# Altium schematic sheet SW6106 Demo board.SchDoc
size A2
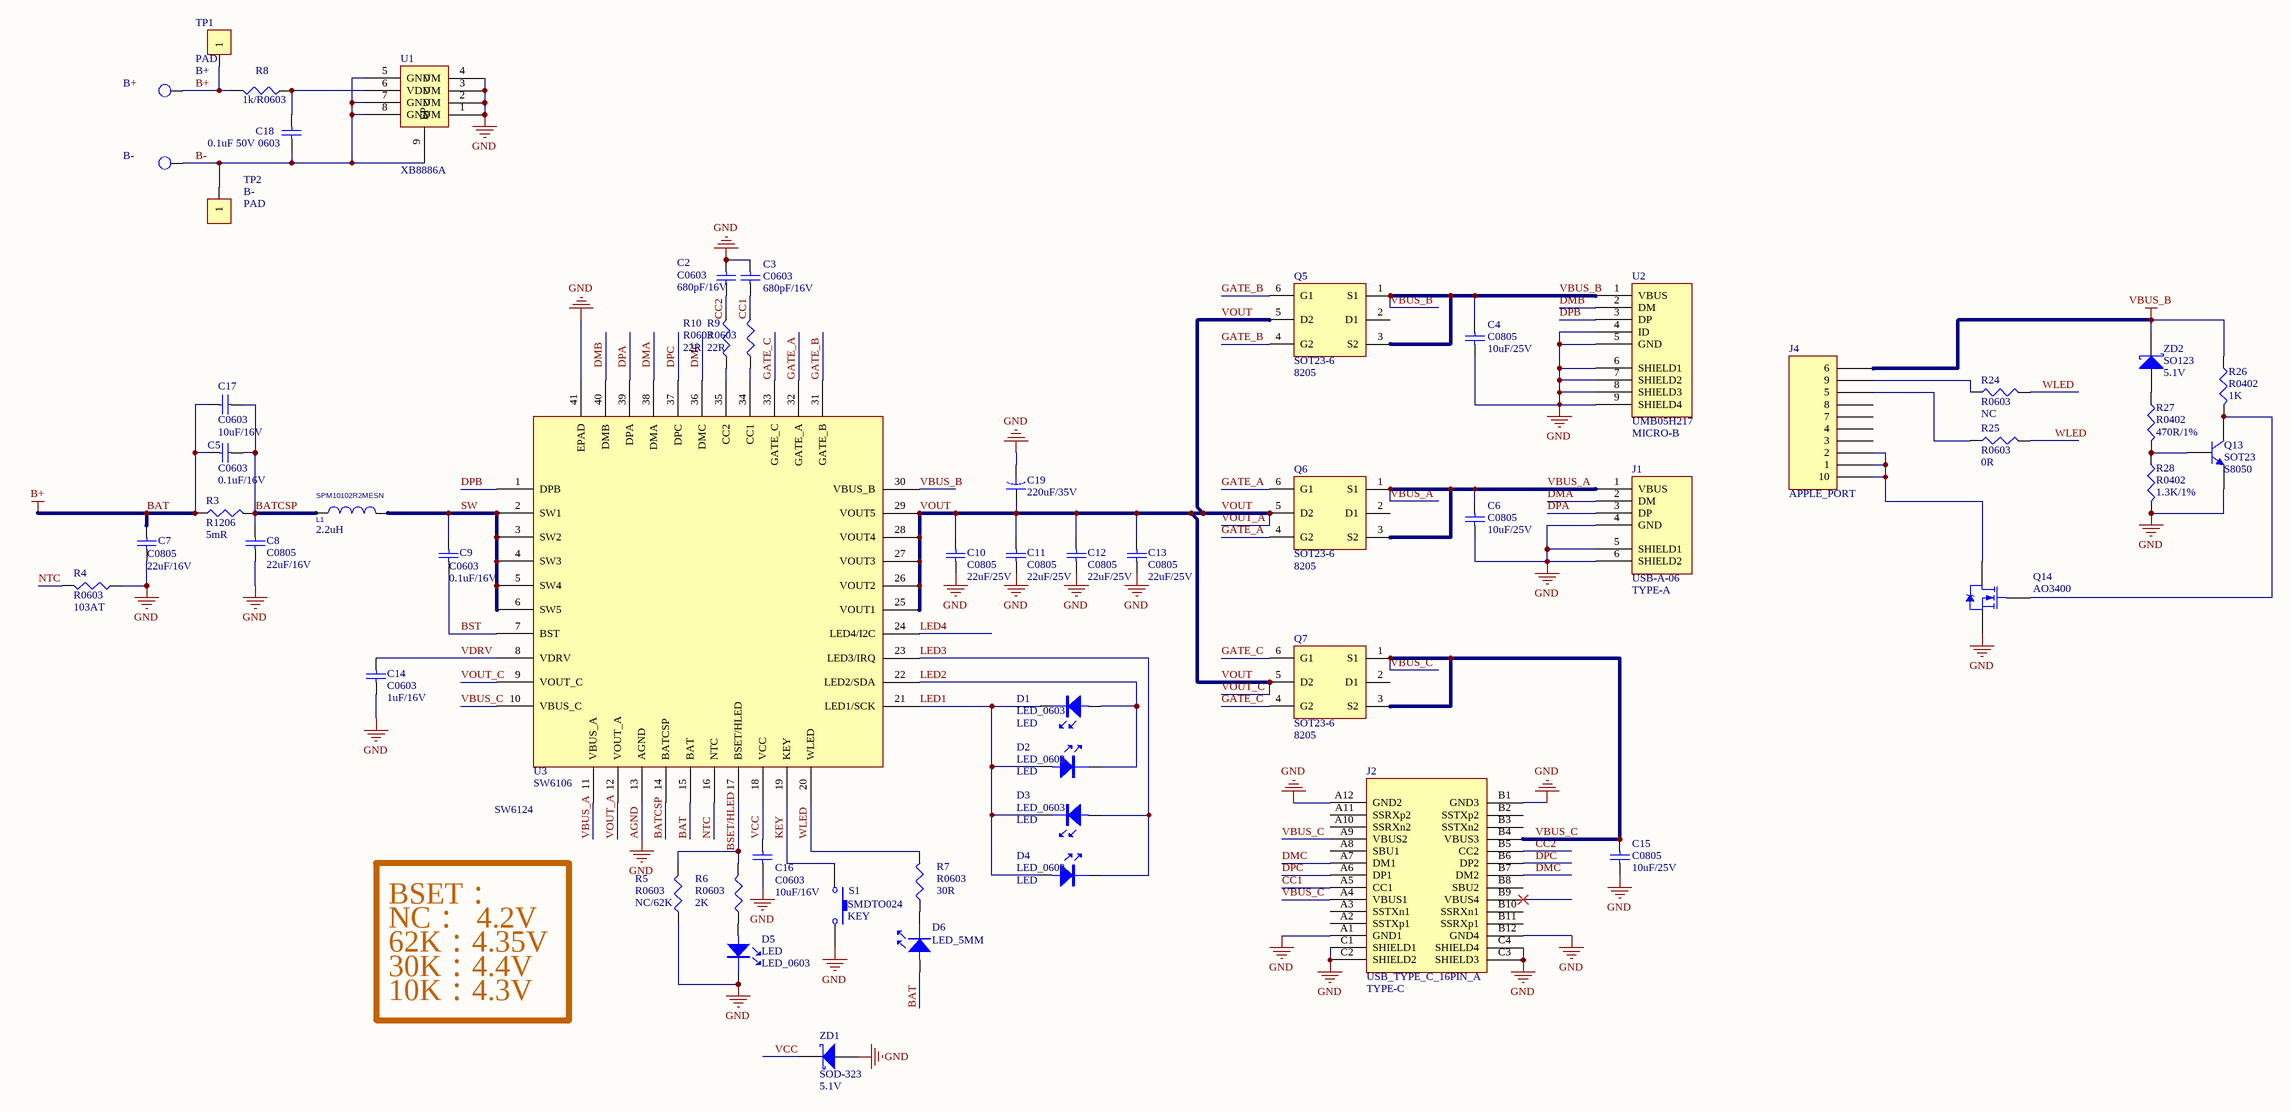
[diagram p0: SW6106 Demo board.SchDoc]

## Parts
B+  PDA  [PAD]  (value not drawn)
B-  PDA  [PAD]  (value not drawn)
C2  C0603  value 680pF/16V  [C0603]
C3  C0603  value 680pF/16V  [C0603]
C4  C0805  value 10uF/25V  [C0805]
C5  C0603  value 0.1uF/16V  [C0603]
C6  C0805  value 10uF/25V  [C0805]
C7  C0805  value 22uF/16V  [C0805]
C8  C0805  value 22uF/16V  [C0805]
C9  C0603  value 0.1uF/16V  [C0603]
C10  C0805  value 22uF/25V  [C0805]
C11  C0805  value 22uF/25V  [C0805]
C12  C0805  value 22uF/25V  [C0805]
C13  C0805  value 22uF/25V  [C0805]
C14  C0603  value 1uF/16V  [C0603]
C15  C0805  value 10uF/25V  [C0805]
C16  C0603  value 10uF/16V  [C0603]
C17  C0603  value 10uF/16V  [C0603]
C18  0.1uF 50V 0603  [C0402]
C19  value 220uF/35V  [Cap  ( E )  6.5 * 12.0  Erect]  (hidden comment: E - Cap)
D1  LED  [LED_0603]
D2  LED  [LED_0603]
D3  LED  [LED_0603]
D4  LED  [LED_0603]
D5  LED  [LED_0603]
D6  LED_5MM  [LED_5MM]
J1  value TYPE-A  [USB-A-06]  (hidden comment: TYPE-A-1)
J2  TYPE-C  [USB_TYPE_C_16PIN_A]
J4  APPLE_PORT  [Lightning]
L1  SPM10102R2MESN  value 2.2uH  [INDUCTOR_SPM1010]
Q5  8205  [SOT23-6]
Q6  8205  [SOT23-6]
Q7  8205  [SOT23-6]
Q13  Footprint: SOT23  [SOT-23]  (hidden comment: S8050)
Q14  value AO3400  [SOT-23-3]  (hidden comment: NMOS-2)
R3  R1206  value 5mR  [R1206]
R4  R0603  value 103AT  [R0603]
R5  R0603  value NC/62K  [R0603]
R6  R0603  value 2K  [R0603]
R7  R0603  value 30R  [R0603]
R8  1k/R0603  [R0402]
R9  R0603  value 22R  [R0603]
R10  R0603  value 22R  [R0603]
R24  R0603  value NC  [R0402]
R25  R0603  value 0R  [R0402]
R26  R0402  value 1K  [R0402]
R27  R0402  value 470R/1%  [R0402]
R28  R0402  value 1.3K/1%  [R0402]
S1  KEY  [SMDTO024]
TP1  B+  [PAD]
TP2  B-  [PAD]
U1  XB8886A  [SOP-8-G]
U2  value MICRO-B  [UMB05H217]  (hidden comment: USB_MICRO_B)
U3  SW6106  value SW6124  [QFN40_EPAD_SW6124_6X6]
ZD1  SOD-323  [SOD-123]
ZD2  5.1V  Footprint: SO123  [SOD-123]

## Nets
AGND: C2.2 C3.2 C4.1 C6.1 C7.1 C8.1 C10.1 C11.1 C12.1 C13.1 C14.1 C15.1 C16.1 C19.2 D5.2(K) J1.4(GND) J1.5(SHIELD1) J1.6(SHIELD2) J2.A1(GND1) J2.A12(GND2) J2.B1(GND3) J2.B12(GND4) J2.C1(SHIELD1) J2.C2(SHIELD2) J2.C3(SHIELD3) J2.C4(SHIELD4) Q13.2(E) Q14.2(S) R4.1 R5.1 R28.2 S1.2 U1.1(VM) U1.2(VM) U1.3(VM) U1.4(VM) U2.4(ID) U2.5(GND) U2.6(SHIELD1) U2.7(SHIELD2) U2.8(SHIELD3) U2.9(SHIELD4) U3.13(AGND) U3.41(EPAD) ZD1.1(A)  [also labelled GND]
B+: B+.0 C5.1 C7.2 C17.2 D6.1(A) R3.1 R8.2 TP1.1 U3.15(BAT)  [also labelled BAT]
VBUS_B: C4.2 J4.6 Q5.1(S1) Q5.3(S2) R26.1 U2.1(VBUS) U3.30(VBUS_B) ZD2.1(K)
B-: B-.0 C18.1 TP2.1 U1.5(GND) U1.7(GND) U1.8(GND) U1.9(EP)
BATCSP: C5.2 C8.2 C17.1 L1.1 R3.2 U3.14(BATCSP)
BSET/HLED: R5.2 R6.2 U3.17(BSET/HLED)
BST: C9.1 U3.7(BST)
CC1: J2.A5(CC1)
CC2: J2.B5(CC2)
DMA: J1.2(DM) U3.38(DMA)
DMB: U2.2(DM) U3.40(DMB)
DMC: J2.A7(DM1) J2.B7(DM2) U3.36(DMC)
DPA: J1.3(DP) U3.39(DPA)
DPB: U2.3(DP) U3.1(DPB)
DPC: J2.A6(DP1) J2.B6(DP2) U3.37(DPC)
GATE_A: Q6.4(G2) Q6.6(G1) U3.32(GATE_A)
GATE_B: Q5.4(G2) Q5.6(G1) U3.31(GATE_B)
GATE_C: Q7.4(G2) Q7.6(G1) U3.33(GATE_C)
KEY: S1.1 U3.19(KEY)
LED1: D1.2(K) D2.1(A) D3.2(K) D4.1(A) U3.21(LED1/SCK)
LED2: D1.1(A) D2.2(K) U3.22(LED2/SDA)
LED3: D3.1(A) D4.2(K) U3.23(LED3/IRQ)
LED4: U3.24(LED4/I2C)
NTC: R4.2 U3.16(NTC)
SW: C9.2 L1.2 U3.2(SW1) U3.3(SW2) U3.4(SW3) U3.5(SW4) U3.6(SW5)
VBUS_A: C6.2 J1.1(VBUS) Q6.1(S1) Q6.3(S2) U3.11(VBUS_A)
VBUS_C: C15.2 J2.A4(VBUS1) J2.A9(VBUS2) J2.B4(VBUS3) Q7.1(S1) Q7.3(S2) U3.10(VBUS_C)
VCC: C16.2 U3.18(VCC) ZD1.2(K)
VDRV: C14.2 U3.8(VDRV)
VOUT: C10.2 C11.2 C12.2 C13.2 C19.1 Q5.5(D2) Q6.5(D2) Q7.5(D2) U3.9(VOUT_C) U3.12(VOUT_A) U3.25(VOUT1) U3.26(VOUT2) U3.27(VOUT3) U3.28(VOUT4) U3.29(VOUT5)  [also labelled VOUT_A, VOUT_C]
WLED: R7.2 R24.2 R25.2 U3.20(WLED)
NetC2_1: C2.1 R10.2
NetC3_1: C3.1 R9.2
NetC18_0: C18.0 R8.1 U1.6(VDD)
NetD5_1: D5.1(A) R6.1
NetD6_2: D6.2(K) R7.1
NetJ4_1: J4.1 J4.2 J4.10 Q14.3(D)
NetJ4_5: J4.5 R25.1
NetJ4_9: J4.9 R24.1
NetQ13_1: Q13.1(B) R27.2 R28.1
NetQ13_3: Q13.3(C) Q14.1(G) R26.2
NetR9_1: R9.1 U3.34(CC1)
NetR10_1: R10.1 U3.35(CC2)
NetR27_1: R27.1 ZD2.3(A)

Not connected (* = marked no-connect by the designer): J2 A2(SSTXp1) A3(SSTXn1) A8(SBU1) A10(SSRXn2) A11(SSRXp2) B2(SSTXp2) B3(SSTXn2) B8(SBU2) B9(VBUS4)* B10(SSRXn1) B11(SSRXp1); J4 3 4 7 8; Q5 2(D1); Q6 2(D1); Q7 2(D1)

## Notes on the sheet
- BSET：
- NC：  4.2V
- 62K：4.35V
- 30K：4.4V
- 10K：4.3V
- Labels drawn without touching a wire or pin: CC1, CC2
- (in symbol Diode 11DQ03) 5.1V

## Library data of the parts
C2-C6 C9 C14-C17 = CAP0603: Capacitor; Published: 8-Jun-2000; LatestRevisionDate: 17-Jul-2002; LatestRevisionNote: Re-released for DXP Platform.; PackageReference: RAD-0.3; Publisher: Altium Limited; PackageDescription: Radial Cap, Thru-Hole; 2 Leads; 0.3 in Pin Spacing
C7 C8 C10-C13 = CAP0805: Capacitor; Published: 8-Jun-2000; LatestRevisionDate: 17-Jul-2002; LatestRevisionNote: Re-released for DXP Platform.; PackageReference: RAD-0.3; Publisher: Altium Limited; PackageDescription: Radial Cap, Thru-Hole; 2 Leads; 0.3 in Pin Spacing
C18 = Cap: 规格: 0603-50V-104-X7R; 物料名称: SMT 陶瓷电容
C19 = E - Cap: Electroytic Capacitor, 100uF/35V, ±20%, 105℃，Φ 6.5 * 12.0 mm; Published: 23-Sep-2002; PackageReference: 6.5*12.0; Publisher: Altium Limited
D1-D5 = LED: 单?: 0.1; Value: LED
D6 = LED: Footprinf: LED_5MM; Value: LED_5MM
L1 = INDUCTOR
Q5-Q7 = 8205B: Value: 8205; Footprinf: SOT23-6
Q13 = 2N3904: NPN General Purpose Amplifier; Published: 8-Jun-2000; LatestRevisionDate: 15-Jan-2003; LatestRevisionNote: PCB Footprint 'BCY-W3/D4.7' replaced; DatasheetVersion: 1997; PackageVersion: Sep-1998; PackageReference: TO-92A; Publisher: Altium Limited; PackageDescription: TO, Flat Index; 3 In-Line, Axial Leads; Body Dia. 4.5mm; Leads 0.51 x 0.48 mm (max); ComponentLink1Description: Manufacturer Link; ComponentLink1URL: http://www.fairchildsemi.com/; ComponentLink2Description: Datasheet; ComponentLink2URL: http://www.fairchildsemi.com/ds/2N%2F2N3904.pdf; Value: S8050
Q14 = NMOS-2: N-Channel Power MOSFET; Note: Pin 2 is electrically connected to pin 4.; Published: 8-Jun-2000; LatestRevisionDate: 17-Jul-2002; LatestRevisionNote: Re-released for DXP Platform.; DatasheetVersion: PD-9.814; PackageReference: TO-220AB; Publisher: Altium Limited; Code_JEDEC: TO-220-AB; ComponentLink1Description: Manufacturer Link; ComponentLink1URL: http://www.irf.com/
R3-R10 R24 R25 = RES: Resistor; Published: 8-Jun-2000; LatestRevisionDate: 29-May-2009; LatestRevisionNote: IPC-7351 Footprint Added.; PackageReference: J1-0603; Publisher: Altium Limited; PackageDescription: Chip Resistor
  R8: Value: 1k/R0603
R26-R28 = Res3: Resistor; Published: 8-Jun-2000; LatestRevisionDate: 29-May-2009; LatestRevisionNote: IPC-7351 Footprint Added.; PackageReference: J1-0603; Publisher: Altium Limited; PackageDescription: Chip Resistor
S1 = SW K: Value: KEY; Footprinf: SMDTO024
TP1 TP2 = Test Point
  TP1: Value: B+
  TP2: Value: B-
U1 = XB8089
U3 = SW6124
ZD1 = Diode 11DQ03: Schottky Rectifier; Published: 8-Jun-2000; LatestRevisionDate: 17-Jul-2002; LatestRevisionNote: Re-released for DXP Platform.; DatasheetVersion: Dec-1997; PackageReference: DO-204AL; Publisher: Altium Limited; PackageDescription: Diode, Axial; Body 5.2 x 2.7 mm (LxDia. max), Lead Dia. 0.86 mm (max); Code_JEDEC: DO-204-AL; ComponentLink1Description: Manufacturer Link; ComponentLink1URL: http://www.irf.com/; ComponentLink2Description: Datasheet; ComponentLink2URL: http://www.irf.com/product-info/datasheets/data/11dq03.pdf
ZD2 = Diode 10TQ035: Schottky Rectifier; Note: Terminal 2 is the TAB and is electrically connected to the cathode; Published: 8-Jun-2000; LatestRevisionDate: 17-Jul-2002; LatestRevisionNote: Re-released for DXP Platform.; DatasheetVersion: PD-2.057B; PackageVersion: Feb-1998; PackageReference: TO-220AC; Publisher: Altium Limited; PackageDescription: TO, Thru-Hole, Vertical, Heatsink Mounted; 3 In-Line Leads (1 Absent); Pitch 2.54 mm; ComponentLink1Description: Manufacturer Link; ComponentLink1URL: http://www.irf.com/; ComponentLink2Description: Datasheet; ComponentLink2URL: http://www.irf.com/product-info/datasheets/data/10tq.pdf
J1 = TYPE-A-1: Footprinf: USB-A-06
J2 = TYPE-C: Value: TYPE-C
J4 = APPLE_PORT: Footprint: *; Value: APPLE_PORT
U2 = USB_MICRO_B: Footprintf: UMB05H217